# EAGLE design nav6 (EAGLE 6.4)

## Sheet 1 of 2
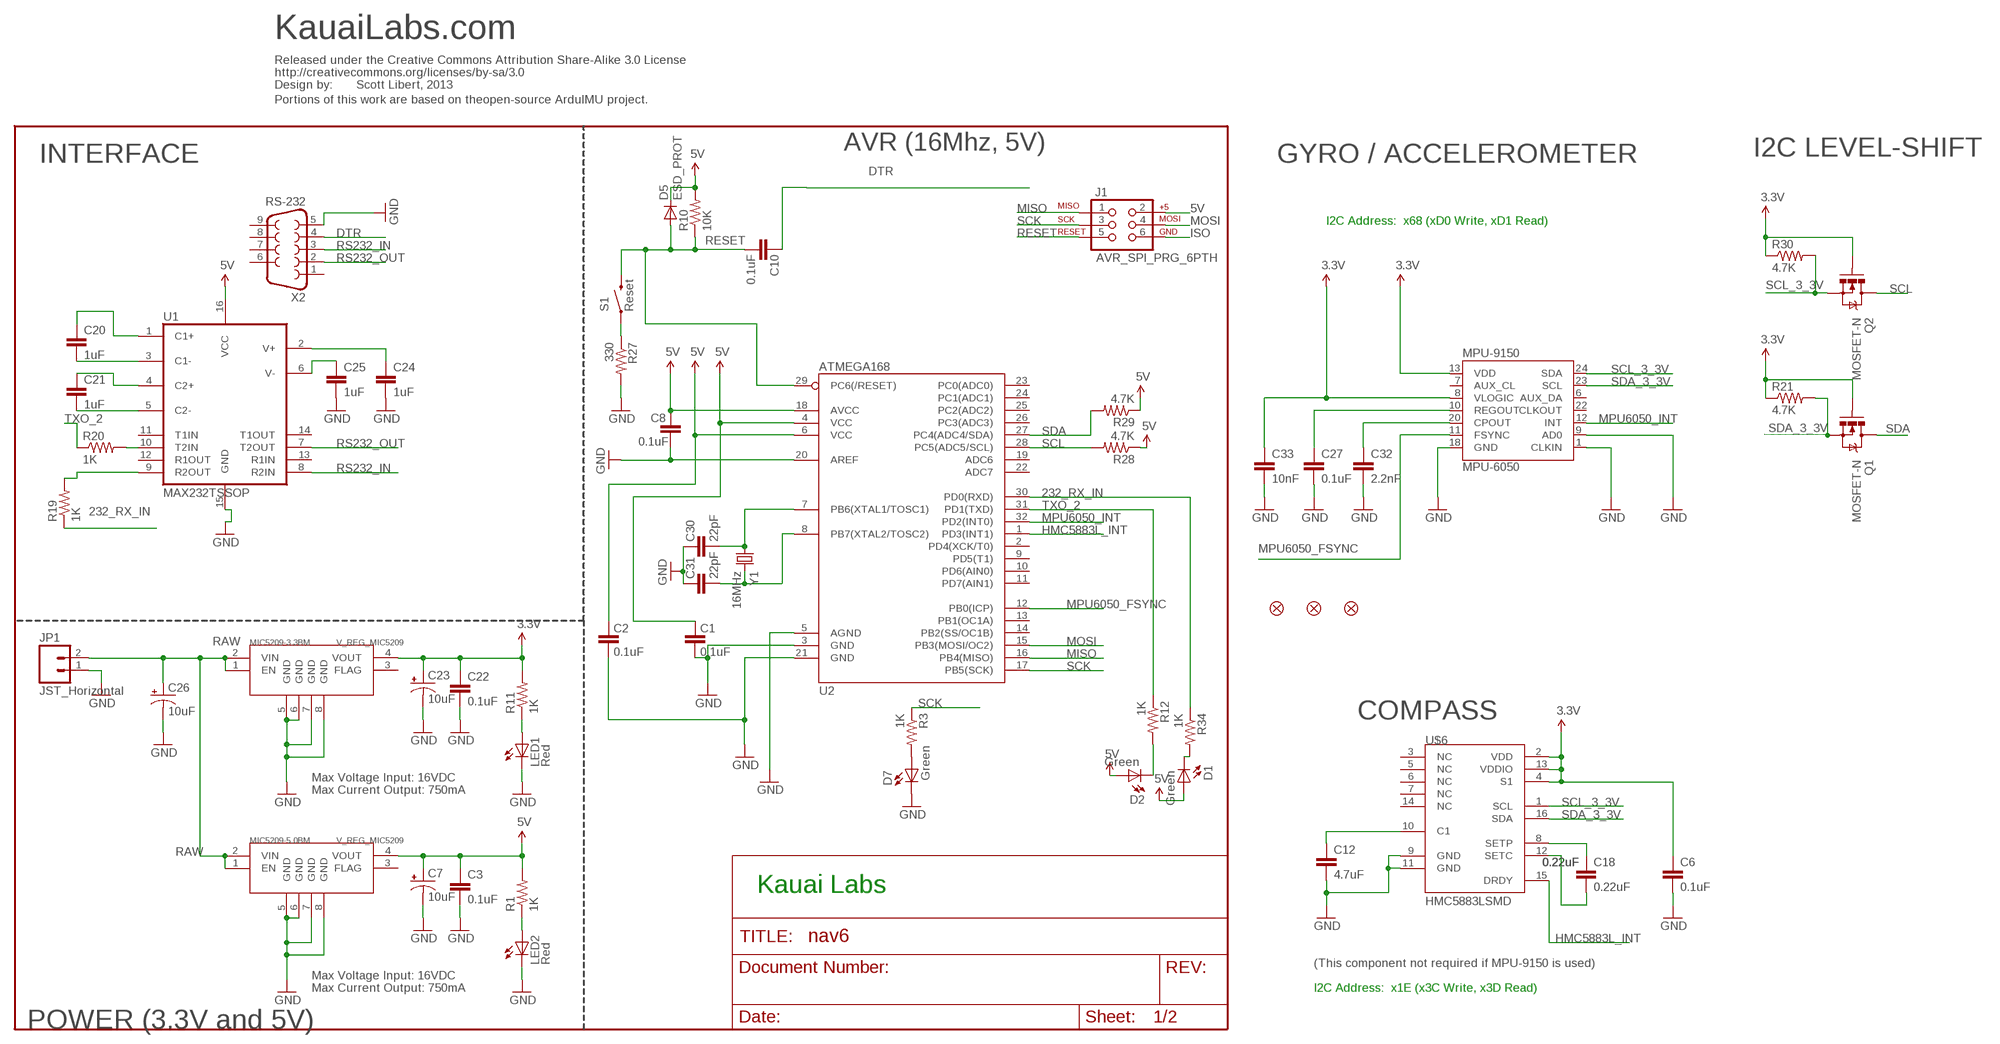
[diagram p0: schematic, sheet 1]

### Parts
C1  0.1uF  CAP0805  [0805]
C2  0.1uF  CAP0805  [0805]
C3  0.1uF  CAP0805  [0805]
C6  0.1uF  CAP0805  [0805]
C7  10uF  CAP_POL1206  [EIA3216]
C8  0.1uF  CAP0805  [0805]
C10  0.1uF  CAP0805  [0805]
C12  4.7uF  CAP0805  [0805]
C18  0.22uF  CAP0805  [0805]
C20  1uF  CAP0805  [0805]
C21  1uF  CAP0805  [0805]
C22  0.1uF  CAP0805  [0805]
C23  10uF  CAP_POL1206  [EIA3216]
C24  1uF  CAP0805  [0805]
C25  1uF  CAP0805  [0805]
C26  10uF  CAP_POL1206  [EIA3216]
C27  0.1uF  CAP0805  [0805]
C30  22pF  CAP0805  [0805]
C31  22pF  CAP0805  [0805]
C32  2.2nF  CAP0805  [0805]
C33  10nF  CAP0805  [0805]
D1  Green  LED1206  [LED-1206]
D2  Green  LED1206  [LED-1206]
D5  ESD_PROT  DIODESOD  [SOD-323]
D7  Green  LED1206  [LED-1206]
J1  AVR_SPI_PRG_6PTH  [2X3]
JP1  JST_Horizontal  M02-JST-2MM-SMT  [JST-2-SMD]
JP2  FIDUCIAL1.5X3  [FIDUCIAL-1.5X3]
JP3  FIDUCIAL1.5X3  [FIDUCIAL-1.5X3]
JP4  FIDUCIAL1.5X3  [FIDUCIAL-1.5X3]
LED1  Red  LED1206  [LED-1206]
LED2  Red  LED1206  [LED-1206]
MIC5209-3.3BM  V_REG_MIC5209  V_REG_MIC3975  [MSOP8]
MIC5209-5.0BM  V_REG_MIC5209  V_REG_MIC3975  [MSOP8]
MPU-9150  MPU-6050  [QFN24_INVENSENSE]
Q1  MOSFET-N  MOSFET-NCHANNELSOT323  [SOT323]
Q2  MOSFET-N  MOSFET-NCHANNELSOT323  [SOT323]
R1  1K  RESISTOR0805-RES  [0805]
R3  1K  RESISTOR0805-RES  [0805]
R10  10K  RESISTOR0805-RES  [0805]
R11  1K  RESISTOR0805-RES  [0805]
R12  1K  RESISTOR0805-RES  [0805]
R19  1K  RESISTOR0805-RES  [0805]
R20  1K  RESISTOR0805-RES  [0805]
R21  4.7K  RESISTOR0805-RES  [0805]
R27  330  RESISTOR0805-RES  [0805]
R28  4.7K  RESISTOR0805-RES  [0805]
R29  4.7K  RESISTOR0805-RES  [0805]
R30  4.7K  RESISTOR0805-RES  [0805]
R34  1K  RESISTOR0805-RES  [0805]
S1  Reset  SWITCH-MOMENTARY-2SMD  [TACTILE_SWITCH_SMD]
U1  MAX232TSSOP  [TSSOP16]
U2  ATMEGA168  [TQFP32-08]
U$1  CREATIVE_COMMONS  [CREATIVE_COMMONS]
U$6  HMC5883LSMD  [16LPCC]
X2  RS-232  DB9FEMALE  [DB9]
Y1  16MHz  CRYSTALTXC-7A  [CRYSTAL-TXC-7A]

### Nets
3.3V [vcc]: C6.1 C22.1 C23.A(+) C33.1 MIC5209-3.3BM.4(VOUT) MPU-9150.8(VLOGIC) MPU-9150.13(VDD) Q1.1(G) Q2.1(G) R11.2 R21.1 R30.1 U$6.2(VDD) U$6.4(S1) U$6.13(VDDIO)
5V [vcc]: C1.2 C2.2 C3.1 C7.A(+) C8.2 D1.A D2.A D5.1(C) J1.2 MIC5209-5.0BM.4(VOUT) R1.2 R10.2 R28.1 R29.1 U1.16(VCC) U2.4(VCC) U2.6(VCC) U2.18(AVCC)
232_RX_IN: R19.1 R34.1 U2.30(PD0(RXD))
DTR: C10.2 X2.4
HMC5883L_INT: U2.1(PD3(INT1)) U$6.15(DRDY)
ISO: C1.1 C2.1 C3.2 C6.2 C7.C(-) C8.1 C12.2 C22.2 C23.C(-) C24.2 C25.2 C26.C(-) C27.2 C30.2 C31.2 C32.2 C33.2 D7.C J1.6 JP1.1 LED1.C LED2.C MIC5209-3.3BM.5(GND) MIC5209-3.3BM.6(GND) MIC5209-3.3BM.7(GND) MIC5209-3.3BM.8(GND) MIC5209-5.0BM.5(GND) MIC5209-5.0BM.6(GND) MIC5209-5.0BM.7(GND) MIC5209-5.0BM.8(GND) MPU-9150.1(CLKIN) MPU-9150.9(AD0) MPU-9150.18(GND) R27.2 U1.15(GND) U2.3(GND) U2.5(AGND) U2.20(AREF) U2.21(GND) U$6.9(GND) U$6.11(GND) X2.5 ; supply symbol labelled GND
MISO: J1.1 U2.16(PB4(MISO))
MOSI: J1.4 U2.15(PB3(MOSI/OC2))
MPU6050_FSYNC: MPU-9150.11(FSYNC) U2.12(PB0(ICP))
MPU6050_INT: MPU-9150.12(INT) U2.32(PD2(INT0))
N$1: C30.1 U2.7(PB6(XTAL1/TOSC1)) Y1.P$1
N$2: C32.1 MPU-9150.20(CPOUT)
N$6: LED2.A R1.1
N$11: C18.2 U$6.8(SETP)
N$13: C18.1 U$6.12(SETC)
N$14: C12.1 U$6.10(C1)
N$15: D1.C R34.2
N$19: D7.A R3.2
N$20: D2.C R12.2
N$36: C24.1 U1.2(V+)
N$37: C25.1 U1.6(V-)
N$38: LED1.A R11.1
N$39: C20.1 U1.1(C1+)
N$40: C20.2 U1.3(C1-)
N$41: C21.1 U1.4(C2+)
N$42: C21.2 U1.5(C2-)
N$43: C27.1 MPU-9150.10(REGOUT)
N$44: R19.2 U1.9(R2OUT)
N$45: R20.2 U1.10(T2IN)
N$52: R27.1 S1.1
N$55: C31.1 U2.8(PB7(XTAL2/TOSC2)) Y1.P$2
RAW [vcc]: C26.A(+) JP1.2 MIC5209-3.3BM.1(EN) MIC5209-3.3BM.2(VIN) MIC5209-5.0BM.1(EN) MIC5209-5.0BM.2(VIN)
RESET: C10.1 D5.2(A) J1.5 R10.1 S1.3 U2.29(PC6(/RESET))
RS232_IN: U1.8(R2IN) X2.3
RS232_OUT: U1.7(T2OUT) X2.2
SCK: J1.3 R3.1 U2.17(PB5(SCK))
SCL: Q2.3(D) R28.2 U2.28(PC5(ADC5/SCL))
SCL_3_3V: MPU-9150.23(SCL) Q2.2(S) R30.2 U$6.1(SCL)
SDA: Q1.3(D) R29.2 U2.27(PC4(ADC4/SDA))
SDA_3_3V: MPU-9150.24(SDA) Q1.2(S) R21.2 U$6.16(SDA)
TXO_2: R12.1 R20.1 U2.31(PD1(TXD))
Unconnected: MIC5209-3.3BM.3(FLAG) MIC5209-5.0BM.3(FLAG) MPU-9150.6(AUX_DA) MPU-9150.7(AUX_CL) MPU-9150.22(CLKOUT) U1.11(T1IN) U1.12(R1OUT) U1.13(R1IN) U1.14(T1OUT) U2.2(PD4(XCK/T0)) U2.9(PD5(T1)) U2.10(PD6(AIN0)) U2.11(PD7(AIN1)) U2.13(PB1(OC1A)) U2.14(PB2(SS/OC1B)) U2.19(ADC6) U2.22(ADC7) U2.23(PC0(ADC0)) U2.24(PC1(ADC1)) U2.25(PC2(ADC2)) U2.26(PC3(ADC3)) U$6.3(NC) U$6.5(NC) U$6.6(NC) U$6.7(NC) U$6.14(NC) X2.1 X2.6 X2.7 X2.8 X2.9

### Notes on the sheet
- KauaiLabs.com
- Scott Libert, 2013
- Portions of this work are based on theopen-source ArduIMU project.
- AVR (16Mhz, 5V) | I2C LEVEL-SHIFT
- INTERFACE | GYRO / ACCELEROMETER
- I2C Address:  x68 (xD0 Write, xD1 Read)
- COMPASS
- Max Voltage Input: 16VDC
- Max Current Output: 750mA
- Kauai Labs
- (This component not required if MPU-9150 is used)
- Max Voltage Input: 16VDC
- Max Current Output: 750mA | I2C Address:  x1E (x3C Write, x3D Read)
- POWER (3.3V and 5V)

## Sheet 2 of 2
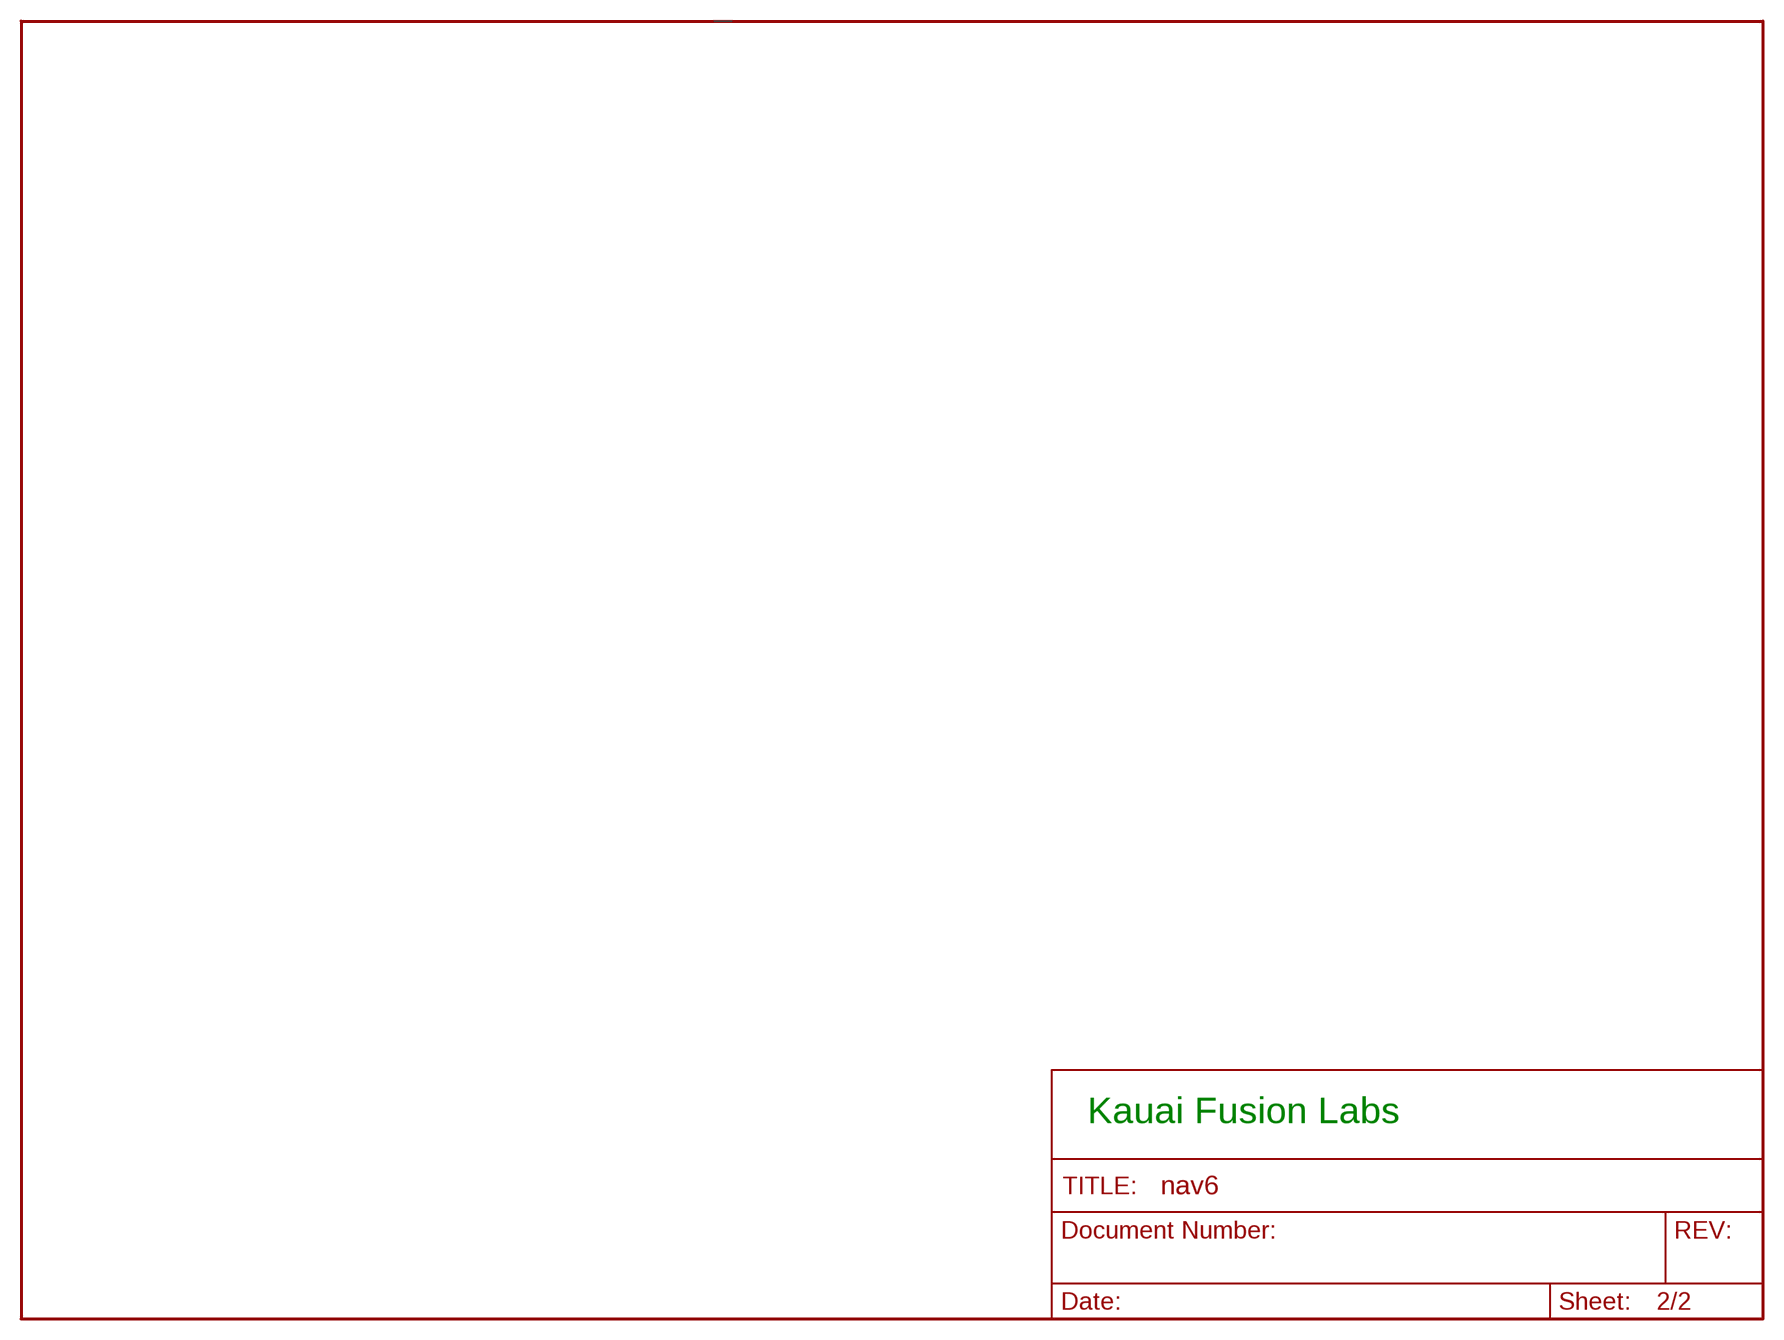
[diagram p1: schematic, sheet 2]

### Notes on the sheet
- Kauai Fusion Labs

## Library data of the parts
C1-C3 C8 C10 C20-C22 C24 C25 C27 C30-C33 = SparkFun:CAP: Capacitor Standard 0603 ceramic capacitor, and 0.1" leaded capacitor.
C6 = SparkFun:CAP: Capacitor Standard 0603 ceramic capacitor, and 0.1" leaded capacitor.; DIGIKEY#: 445-3462-1-ND
C7 C23 C26 = SparkFun:CAP_POL: Capacitor Polarized These are standard SMD and PTH capacitors. Normally 10uF, 47uF, and 100uF in electrolytic and tantalum varieties. Always verify the external diameter of the through hole cap, it varies with capacity, voltage, and manufacturer. The EIA devices should be standard.
C12 = SparkFun:CAP: Capacitor Standard 0603 ceramic capacitor, and 0.1" leaded capacitor.; DIGIKEY#: 445-3457-1-ND
C18 = SparkFun:CAP: Capacitor Standard 0603 ceramic capacitor, and 0.1" leaded capacitor.; DIGIKEY#: 445-1350-1-ND
D1 D2 D7 LED1 LED2 = SparkFun:LED: LEDs Standard schematic elements and footprints for 5mm, 3mm, 1206, and 0603 sized LEDs. 5mm - Spark Fun Electronics SKU : COM-00529 (and others)
D5 = SparkFun-DiscreteSemi:DIODE: Diode These are standard reverse protection diodes and small signal diodes. SMA package can handle up to about 1A. SOD-323 can handle about 200mA. What the SOD-323 package when ordering, there are some mfgs out there that are 5-pin packages.
J1 = SparkFun:AVR_SPI_PRG_6: AVR ISP 6 Pin This is the reduced ISP connector for AVR programming. Common on Arduino. This footprint will take up less PCB space and can be used with a 10-pin to 6-pin adapter such as SKU: BOB-08508
JP1 = SparkFun:M02: Header 2 Standard 2-pin 0.1" header. Use with straight break away headers (SKU : PRT-00116), right angle break away headers (PRT-00553), swiss pins (PRT-00743), machine pins (PRT-00117), and female headers (PRT-00115). Molex polarized connector foot print use with SKU : PRT-08233 with associated crimp pins and housings.
JP2-JP4 = SparkFun:FIDUCIAL: Fiducial Alignment Points Various fiducial points for machine vision alignment.
MIC5209-3.3BM MIC5209-5.0BM = SparkFun-PowerIC:V_REG_MIC3975
MPU-9150 = KauaiFusionLabs:MPU-6050
Q1 Q2 = SparkFun-DiscreteSemi:MOSFET-NCHANNEL: Generic NMOS footprint
R1 R3 R10-R12 R19-R21 R27-R30 R34 = SparkFun:RESISTOR: Resistor Basic schematic elements and footprints for 0603, 1206, and PTH resistors.
S1 = SparkFun:SWITCH-MOMENTARY-2
U1 = SparkFun-DigitalIC:MAX232: RS232 Transceiver Very common IC. This is generically called 'MAX232', but works with the 3V equivalent MAX3232 generic ICs. Field tested and mother approved. Spark Fun Electronics SKU : COM-00316 (DIP) and COM-00589 (SMD)
U2 = SparkFun:ATMEGA168
U$1 = SparkFun:CREATIVE_COMMONS
U$6 = SparkFun:HMC5883L: 3 Axis Digital Compass IC; DIGIKEY#: 342-1082-1-ND
X2 = SparkFun-Connectors:DB9: DB9 Connector Standard DB9 (D-Sub 9) serial connector. Can be used for CAN bus as well as RS485 and RS232. Footprint production proven. Spark Fun Electronics SKU : PRT-00429
Y1 = SparkFun-FreqCtrl:CRYSTAL: Various standard crystals. Proven footprints. Spark Fun Electronics SKU : COM-00534

## Net classes
1 vcc: width 0.254 mm

## Board
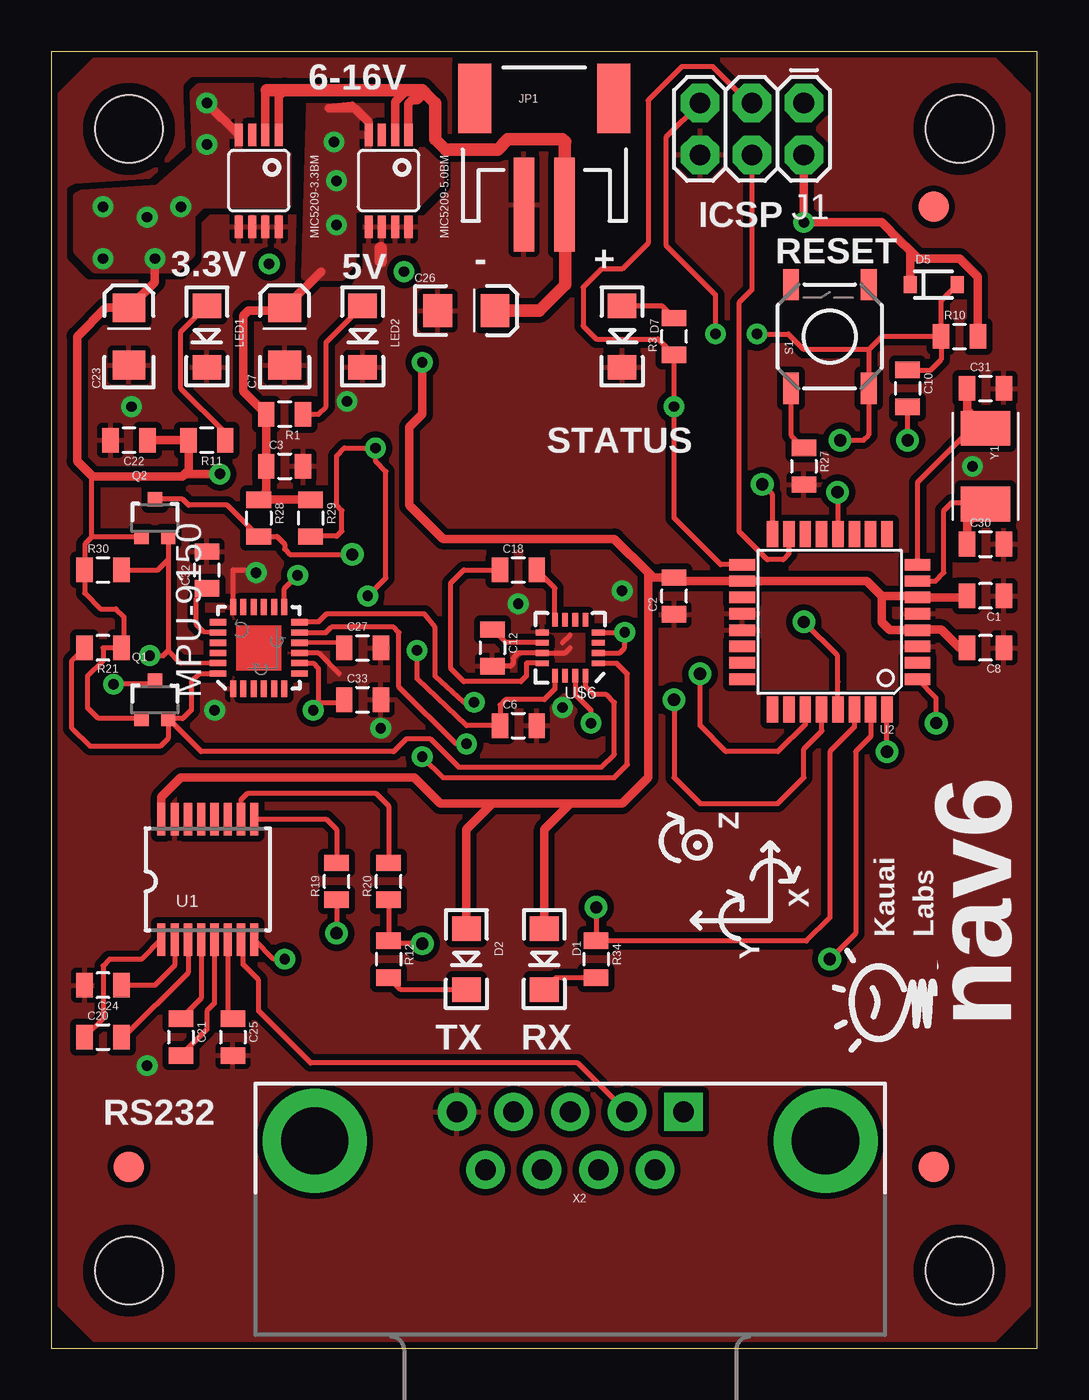
[diagram p2: board, top side]
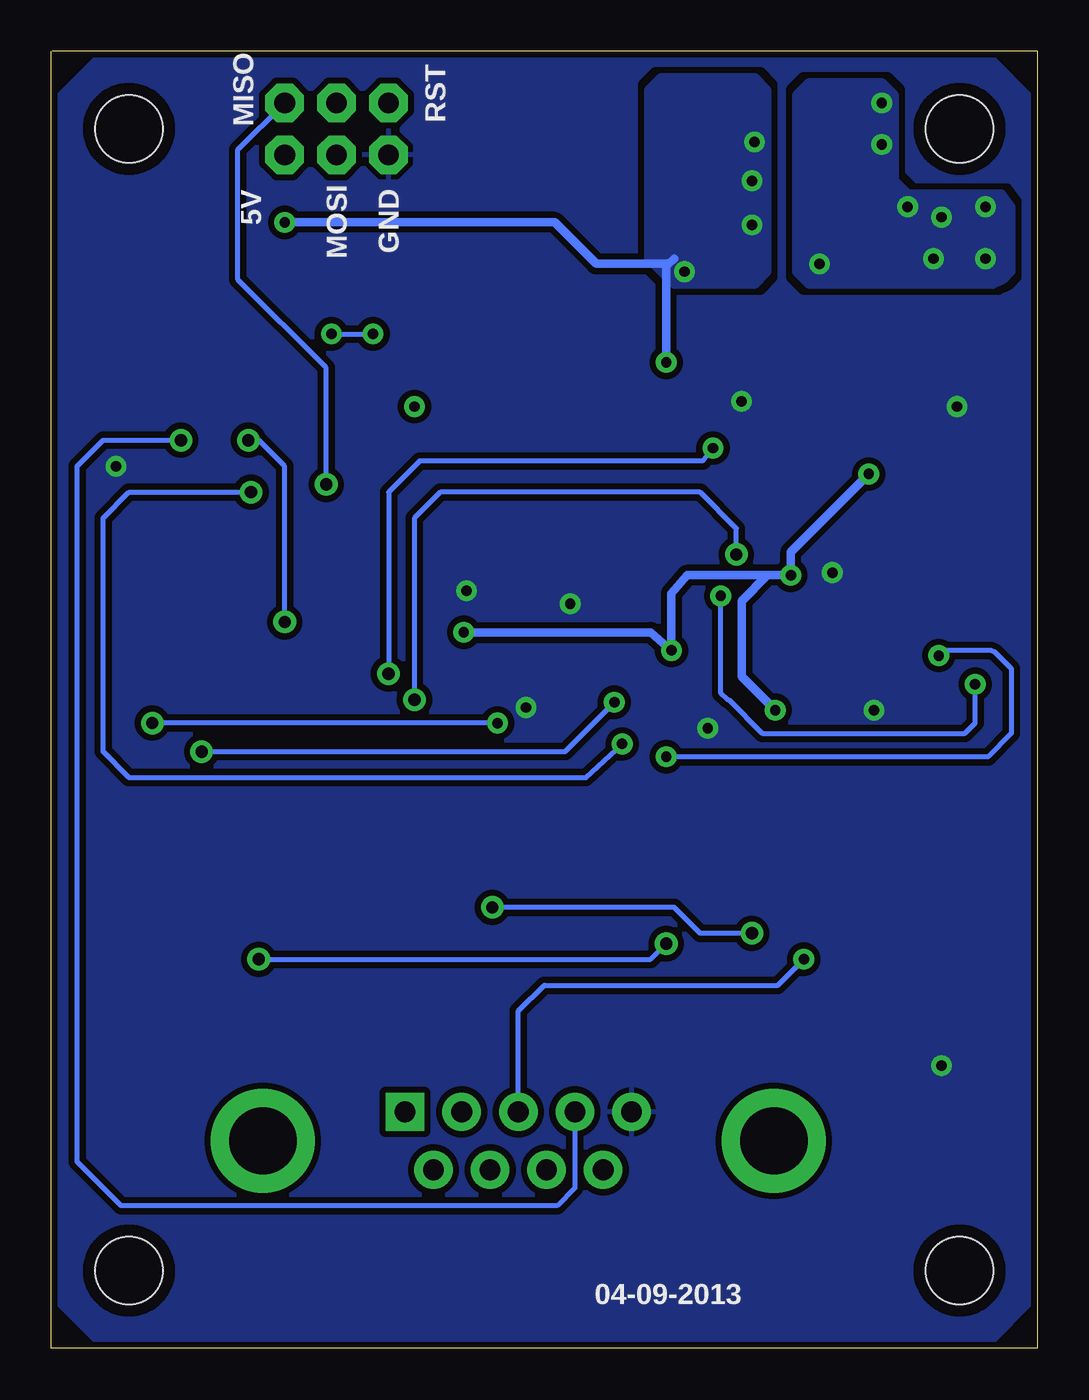
[diagram p3: board, bottom side, seen from below]

Size 48.26 x 63.5 mm. Coordinates in mm from the lower left corner, seen from the top.
Outline: 48.26,63.5 48.26,0 0,0 0,63.49
Outline: 0,63.5 48.2,63.5
Copper layers (1*16): Top 0.035mm / dielectric 1.5mm / Bottom 0.035mm
Design rules "default": minimum track width 8mil, minimum drill 20mil, track to track 8mil, track to pad 8mil, pad to pad 8mil, via to via 8mil, smd to smd 8mil, copper to edge 10mil, drill to drill 8mil, minimum pad ring 12mil, minimum via ring 10mil, stop-mask expansion 4mil, vias tented up to drill 25mil, thermal gap 10mil

### Footprints (pad centres in the part's own frame; a part is rotated, then mirrored left to right if it is on the bottom)
0805 = smd 0.8 x 1.2: 1 -0.9,0; 2 0.9,0
EIA3216 = smd 1.4 x 1.6: A 1.4,0; C -1.4,0
LED-1206 = smd 1.2 x 1.4: A -1.5,0; C 1.5,0
SOD-323 = smd 0.63 x 0.83: 1 -1.15,0; 2 1.15,0
2X3 = drill 1.016 pad 1.88 octagon: 1 0,0; 2 0,2.54; 3 2.54,0; 4 2.54,2.54; 5 5.08,0; 6 5.08,2.54
JST-2-SMD = smd 1 x 4.6: 1 -1,-3.7; 2 1,-3.7 | smd 1.6 x 3.4: NC1 -3.4,1.5; NC2 3.4,1.5
FIDUCIAL-1.5X3 = smd 1.5 x 1.5: 1 0,0
MSOP8 = smd 0.4 x 1.1: 1 -0.975,-2.25; 2 -0.325,-2.25; 3 0.325,-2.25; 4 0.975,-2.25; 5 0.975,2.25; 6 0.325,2.25; 7 -0.325,2.25; 8 -0.975,2.25
QFN24_INVENSENSE = smd 0.8 x 0.3: 1 -2,1.25; 2 -2,0.75; 3 -2,0.25; 4 -2,-0.25; 5 -2,-0.75; 6 -2,-1.25; 13 2,-1.25; 14 2,-0.75; 15 2,-0.25; 16 2,0.25; 17 2,0.75; 18 2,1.25 | smd 0.3 x 0.8: 7 -1.25,-2; 8 -0.75,-2; 9 -0.25,-2; 10 0.25,-2; 11 0.75,-2; 12 1.25,-2; 19 1.25,2; 20 0.75,2; 21 0.25,2; 22 -0.25,2; 23 -0.75,2; 24 -1.25,2
SOT323 = smd 0.7 x 0.7: 1 -0.65,-0.925; 2 0.65,-0.925; 3 0,0.925
TACTILE_SWITCH_SMD = smd 1.524 x 0.762: 1 -2.54,1.905; 2 2.54,1.905; 3 -2.54,-1.905; 4 2.54,-1.905
TSSOP16 = smd 0.4 x 1.6: 1 -2.225,-2.85; 2 -1.575,-2.85; 3 -0.925,-2.85; 4 -0.275,-2.85; 5 0.375,-2.85; 6 1.025,-2.85; 7 1.675,-2.85; 8 2.325,-2.85; 9 2.325,3.05; 10 1.675,3.05; 11 1.025,3.05; 12 0.375,3.05; 13 -0.275,3.05; 14 -0.925,3.05; 15 -1.575,3.05; 16 -2.225,3.05
TQFP32-08 = smd 1.27 x 0.559: 1 -4.293,2.8; 2 -4.293,2; 3 -4.293,1.2; 4 -4.293,0.4; 5 -4.293,-0.4; 6 -4.293,-1.2; 7 -4.293,-2; 8 -4.293,-2.8; 17 4.293,-2.8; 18 4.293,-2; 19 4.293,-1.2; 20 4.293,-0.4; 21 4.293,0.4; 22 4.293,1.2; 23 4.293,2; 24 4.293,2.8 | smd 0.559 x 1.27: 9 -2.8,-4.293; 10 -2,-4.293; 11 -1.2,-4.293; 12 -0.4,-4.293; 13 0.4,-4.293; 14 1.2,-4.293; 15 2,-4.293; 16 2.8,-4.293; 25 2.8,4.293; 26 2,4.293; 27 1.2,4.293; 28 0.4,4.293; 29 -0.4,4.293; 30 -1.2,4.293; 31 -2,4.293; 32 -2.8,4.293
STAND-OFF = hole 3.302: 0,0
16LPCC = smd 0.65 x 0.28: 1 -1.37,0.75; 2 -1.37,0.25; 3 -1.37,-0.25; 4 -1.37,-0.75; 9 1.37,-0.75; 10 1.37,-0.25; 11 1.37,0.25; 12 1.37,0.75 | smd 0.28 x 0.65: 5 -0.75,-1.37; 6 -0.25,-1.37; 7 0.25,-1.37; 8 0.75,-1.37; 13 0.75,1.37; 14 0.25,1.37; 15 -0.25,1.37; 16 -0.75,1.37
DB9 = drill 1.016 pad 1.88 square: 1 -5.54,-1.42 | drill 1.016 pad 1.88: 2 -2.77,-1.42; 3 0,-1.42; 4 2.77,-1.42; 5 5.54,-1.42; 6 -4.15,1.42; 7 -1.38,1.42; 8 1.38,1.42; 9 4.15,1.42 | drill 3.302 pad 5.08: G1 -12.5,0; G2 12.5,0
CRYSTAL-TXC-7A = smd 1.7 x 2.4: P$1 1.85,0; P$2 -1.85,0

### Placement (x,y rotation side)
C1  45.72,36.83 180 top
C2  30.48,36.83 90 top
C3  11.43,43.18 0 top
C6  22.86,30.48 0 top
C7  11.43,49.53 90 top
C8  45.72,34.29 180 top
C10  41.91,46.99 270 top
C12  21.59,34.29 270 top
C18  22.86,38.1 0 top
C20  2.54,15.24 0 top
C21  6.35,15.24 270 top
C22  3.81,44.45 180 top
C23  3.81,49.53 90 top
C24  2.54,17.78 180 top
C25  8.89,15.24 270 top
C26  20.32,50.8 0 top
C27  15.24,34.29 0 top
C30  45.72,39.37 0 top
C31  45.72,46.99 0 top
C32  7.62,38.1 90 top
C33  15.24,31.75 0 top
D1  24.13,19.05 270 top
D2  20.32,19.05 270 top
D5  43.18,52.07 0 top
D7  27.94,49.53 270 top
J1  36.83,60.96 180 top
JP1  24.13,59.69 0 top
JP2  3.81,8.89 0 top
JP3  43.18,8.89 0 top
JP4  43.18,55.88 0 top
LED1  7.62,49.53 270 top
LED2  15.24,49.53 270 top
MIC5209-3.3BM  10.16,57.15 180 top
MIC5209-5.0BM  16.51,57.15 180 top
MPU-9150  10.16,34.29 90 top
Q1  5.08,31.75 0 top
Q2  5.08,40.64 0 top
R1  11.43,45.72 180 top
R3  30.48,49.53 90 top
R10  44.45,49.53 0 top
R11  7.62,44.45 180 top
R12  16.51,19.05 270 top
R19  13.97,22.86 90 top
R20  16.51,22.86 90 top
R21  2.54,34.29 180 top
R27  36.83,43.18 270 top
R28  10.16,40.64 270 top
R29  12.7,40.64 270 top
R30  2.54,38.1 0 top
R34  26.67,19.05 270 top
S1  38.1,49.53 90 top
U1  7.62,22.86 0 top
U2  38.1,35.56 180 top
U$2  STAND-OFF  [STAND-OFF]  3.81,3.81 0 top
U$3  STAND-OFF  [STAND-OFF]  44.45,59.69 0 top
U$4  STAND-OFF  [STAND-OFF]  3.81,59.69 0 top
U$6  25.4,34.29 180 top
U$8  STAND-OFF  [STAND-OFF]  44.45,3.81 0 top
X2  25.4,10.16 180 top
Y1  45.72,43.18 270 top

### Tracks (layer width: path | path; a pad name or v marks a point on that pad's centre or on a via)
3.3V  (via drill 0.51)
  Top 0.254: Q2.1 2,39.71 | 2,39.71 1.65,39.37 1.65,38.11 R30.1 1.64,36.97 2.41,36.2 3.17,36.2 3.56,35.81 3.56,34.41 R21.1 2.54,34.29 2.54,33.66 1.78,32.89 1.78,31.37 2.29,30.86 4.39,30.86 Q1.1 | 2,39.71 2,42.71 1.4,43.31 | U$6.13 24.65,32.27 24.13,31.75 22.23,31.75 21.97,31.5 21.97,30.49 C6.1 20.32,30.48 17.91,32.77 v17.91,34.16 | U$6.4 28.05,35.04 v28.07,35.05 28.07,34.29 27.82,34.04 U$6.2 | MPU-9150.13 11.41,37.19 v12.06,37.85 | 13.08,31.62 13.08,33.27 12.81,33.54 MPU-9150.8 | 13.08,31.62 v12.83,31.24 | 13.08,31.62 14.21,31.62 C33.1
  Top 0.406: 6.54,42.8 6.41,42.67 2.03,42.67 1.4,43.31 1.27,43.43 1.27,49.53 2.67,50.93 C23.A 5.08,52.2 v5.08,53.34 | 6.54,42.8 6.73,42.99 R11.2 C22.1 | 6.54,42.8 v8.25,42.8 | 7.91,60.66 v7.62,60.96 MIC5209-3.3BM.4
  Bottom 0.406: v12.06,37.85 12.06,38.99 v8.25,42.8 | v12.06,37.85 17.14,37.85 17.91,36.96 v17.91,34.16 18.92,35.05 v28.07,35.05 | v12.06,37.85 13.21,37.85 14.48,36.58 14.48,32.89 v12.83,31.24
  other vias: 2.54,55.88 2.54,53.34 4.7,55.37 6.35,55.88 7.62,58.93 10.67,53.09
  pour Top (isolate 0.305): 11.56,56.01 11.56,60.83 10.67,61.72 7.24,61.72 6.98,61.47 7.11,58.42 5.21,56.77 1.52,56.52 1.27,56.39 1.27,53.72 2.16,52.83 6.1,52.83 6.86,53.59 6.86,55.5 7.37,56.01
  pour Bottom (isolate 0.305): 1.78,56.52 6.35,56.52 6.98,57.15 6.98,61.34 7.62,61.98 11.18,61.98 11.81,61.34 11.81,52.7 11.18,52.07 2.17,52.07 1.84,52.21 1.63,52.35 1.27,52.7 1.27,55.89 1.75,56.51
5V  (via drill 0.51)
  Top 0.254: 36.83,58.05 J1.2
  Top 0.406: J1.2 v36.83,55.12 40.64,55.12 41.53,54.23 42.03,53.73 | R10.2 45.34,49.54 45.34,52.45 44.45,53.34 42.42,53.34 42.03,53.73 | C7.A | R29.1 R28.1 10.53,41.91 C3.1 R1.2 9.4,46.85 9.4,50.55 9.65,50.8 11.3,50.8 C7.A | 13.21,52.71 C7.A | 14.73,60.83 13.59,60.71 14.86,60.71 15.53,60.03 MIC5209-5.0BM.4 | v18.16,48.26 18.16,45.72 17.53,45.09 17.53,41.27 19.18,39.62 27.56,39.62 29.21,37.97 | 29.21,37.97 29.45,37.73 C2.2 30.65,37.56 U2.18 39.91,37.56 40.64,36.83 | 40.64,36.83 42.32,36.83 U2.6 44.75,36.76 C1.2 | 40.64,36.83 40.64,35.56 41.04,35.16 U2.4 42.41,35.18 43.56,35.18 44.45,34.29 C8.2 | U1.16 5.39,26.98 6.35,27.94 17.78,27.94 19.05,26.67 21.59,26.67 | 21.59,26.67 25.4,26.67 | 25.4,26.67 27.94,26.67 29.21,27.94 29.21,37.97 | D2.A 20.32,25.4 21.59,26.67 | D1.A 24.13,25.4 25.4,26.67 | D5.1 42.03,53.73
  Bottom 0.406: 18.03,53.09 21.59,53.09 23.62,55.12 v36.83,55.12 | 18.03,53.09 17.78,53.34 | v18.16,48.26 18.16,52.96 18.03,53.09
  other vias: 13.97,57.15 13.97,54.99 17.27,52.7 13.84,59.05
  pour Top (isolate 0.305): 12.45,52.45 14.22,52.45 14.73,53.21 14.73,55.75 17.78,55.88 19.05,57.15 19.05,62.48 13.46,62.48 12.7,61.72
  pour Bottom (isolate 0.305): 19.05,53.34 19.05,61.59 18.41,62.23 13.84,62.23 13.21,61.59 13.21,52.7 13.84,52.07 17.78,52.07
232_RX_IN  (via drill 0.6)
  Top 0.254: U2.30 39.3,30.41 38.1,29.21 38.1,21.08 36.96,19.94 R34.1 v26.67,21.59 | R19.1 v13.97,20.32
  Bottom 0.254: v13.97,20.32 16.51,20.32 17.78,21.59 v26.67,21.59
DTR  (via drill 0.6)
  Top 0.254: v41.91,44.45 C10.2
  Bottom 0.254: X2.4 22.63,7.85 23.49,6.99 44.83,6.99 46.99,9.14 46.99,43.18 45.72,44.45 v41.91,44.45
HMC5883L_INT  (via drill 0.51, 0.6)
  Top 0.254: U$6.15 25.65,32.01 26.42,31.24 v26.42,30.61 | v43.31,30.61 43.31,31.85 U2.1
  Bottom 0.254: v26.42,30.61 v43.31,30.61
ISO  (via drill 0.51)
  Top 0.254: 25.02,34.54 25.4,34.92 | 25.4,34.29 25.15,34.04 U$6.11 22.86,34.04 22.61,33.78 22.61,33.53 22.48,33.4 21.6,33.4 C12.2 | MPU-9150.18 8.9,38.09 8.89,38.1 9.91,38.1 v10.03,37.97 | 14.1,33.02 13.08,34.03 MPU-9150.9
  Top 0.61: 16.13,53.21 16.13,53.85
  other vias: 3.94,46.1 14.48,46.35 8,31.24 27.94,37.08 16.13,30.35 25.02,31.37 4.7,13.84 22.86,36.45 45.09,43.18
  pour Bottom (isolate 0.305, rank 2): 0,60.96 0,2.54 2.54,0 45.72,0 48.26,2.54 48.26,60.96 45.72,63.5 2.54,63.5
  pour Top (isolate 0.305, rank 2): 0,60.96 0,2.54 2.54,0 45.72,0 48.26,2.54 48.26,60.96 45.72,63.5 2.54,63.5
  pour Top (isolate 0.305): 43.18,46.99 44.45,48.26 47.62,48.26 47.62,38.48 47.24,38.1 44.32,38.1 43.05,39.37 43.05,46.86
MISO  (via drill 0.6)
  Top 0.254: U2.16 35.3,41.79 v34.8,42.29
  Bottom 0.254: v34.8,42.29 34.8,48.01 39.12,52.32 39.12,58.67 J1.1
MOSI
  Top 0.254: U2.15 36.1,38.89 35.81,38.61 35.05,38.61 33.66,40 33.66,51.18 34.29,51.82 J1.4
MPU6050_FSYNC  (via drill 0.51, 0.6)
  Top 0.254: MPU-9150.11 13.45,35.04 13.72,35.31 16.76,35.31 17.02,35.05 17.02,32.38 19.81,29.59 v20.32,29.59 | v38.48,41.91 38.48,39.87 U2.12
  Bottom 0.254: v20.32,29.59 22.1,27.94 44.45,27.94 45.72,29.21 45.72,40.64 44.45,41.91 v38.48,41.91
MPU6050_INT  (via drill 0.51, 0.6)
  Top 0.254: MPU-9150.12 12.27,35.56 13.08,35.56 13.46,35.94 18.29,35.94 18.8,35.31 18.8,32.89 20.19,31.62 v20.7,31.62 | v40.89,29.21 U2.32
  Bottom 0.254: v40.89,29.21 23.11,29.21 v20.7,31.62
N$1
  Top 0.254: U2.7 43.27,37.56 43.69,37.97 43.69,41.02 44.07,41.4 45.65,41.4
  Top 0.406: 45.65,41.4 Y1.P$1 44.82,40.43 C30.1
N$2
  Top 0.254: 8.06,35.05 MPU-9150.20 7.47,35.07 7.11,35.43 7.11,36.69 C32.1
N$6
  Top 0.254: R1.1 13.08,45.72 13.46,46.1 13.46,49.25 LED2.A
N$11
  Top 0.254: U$6.8 24.65,37.21 C18.2
N$13
  Top 0.254: C18.1 20.19,38.1 19.56,37.46 19.56,33.27 20.19,32.64 22.99,32.64 23.25,32.91 23.25,33.54 U$6.12
N$14
  Top 0.254: U$6.10 22.24,34.54 C12.1
N$15
  Top 0.254: D1.C 24.73,18.15 R34.2
N$19
  Top 0.254: 30.34,50.43 R3.2 29.88,51.03 D7.A
N$20
  Top 0.254: D2.C 17.11,17.55 R12.2
N$36
  Top 0.254: U1.2 6.04,18.74 5.08,17.78 C24.1
N$37
  Top 0.254: U1.6 8.64,16.38 C25.1
N$38
  Top 0.254: R11.1 8.52,44.82 6.35,46.99 6.35,49.76 LED1.A
N$39
  Top 0.254: 5.32,19.94 U1.1 4.43,19.05 2.86,19.05 2.54,18.73 2.54,16.14 C20.1
N$40
  Top 0.254: C20.2 3.56,15.24 6.73,18.41 6.73,19.97 U1.3
N$41
  Top 0.254: U1.4 7.34,17.13 C21.1
N$42
  Top 0.254: U1.5 7.99,16.88 7.62,16.51 7.62,15.61 C21.2
N$43
  Top 0.254: 12.3,34.54 MPU-9150.10 14.06,34.57 C27.1
N$44
  Top 0.254: 9.91,25.87 U1.9 13.46,25.91 13.97,25.4 R19.2
N$45
  Top 0.254: U1.10 9.29,26.86 9.63,27.18 9.65,27.18 15.88,27.18 16.51,26.54 R20.2
N$52
  Top 0.254: S1.1 36.2,44.71 R27.1
N$55
  Top 0.254: 42.39,38.46 42.39,42.39 45.38,45.38
  Top 0.406: U2.8 42.39,38.46 | C31.1 44.82,45.93 45.38,45.38 Y1.P$2
RAW
  Top 0.406: MIC5209-5.0BM.2 16.84,61.03 17.4,61.59 | MIC5209-3.3BM.2 10.48,61.54 10.54,61.59 | MIC5209-3.3BM.1 11.13,61.3 11.43,61.59 | MIC5209-5.0BM.1 17.48,60.92 17.65,61.09 17.91,61.09 18.29,61.47
  Top 0.61: C26.A 23.88,50.8 25.15,52.07 25.15,55.97 JP1.2 25.13,59.04 25.15,59.05 25.02,59.18 22.35,59.18 21.84,58.67 19.3,58.67 18.8,59.18 18.8,60.96 18.29,61.47 18.16,61.59 17.4,61.59 11.43,61.59 10.54,61.59
RESET  (via drill 0.51, 0.6)
  Top 0.254: v32.51,49.66 32.51,51.56 30.1,53.98 30.1,59.31 J1.5 | R10.1 43.55,48.4 43.04,47.89 C10.1 | v34.54,49.66 36.07,49.66 36.83,48.89 40,48.89 | 40,48.89 S1.3 40,44.71 39.74,44.45 v38.61,44.45 | R10.1 40.64,49.53 40,48.89 | U2.29 38.5,32.62 38.48,33.91 v36.83,35.56 | R10.1 43.55,51.29 D5.2
  Bottom 0.254: v34.54,49.66 v32.51,49.66 | v36.83,35.56 36.83,43.18 38.1,44.45 v38.61,44.45
RS232_IN  (via drill 0.51)
  Top 0.254: v11.43,19.05 10.9,19.05 U1.8
  Bottom 0.254: v11.43,19.05 12.7,17.78 24.13,17.78 25.4,16.51 X2.3
RS232_OUT
  Top 0.254: 9.27,19.99 U1.7 9.4,19.91 9.4,18.8 10.16,18.03 10.16,16.51 12.7,13.97 25.78,13.97 X2.2
SCK  (via drill 0.51)
  Top 0.254: U2.17 32.76,38.36 30.48,40.64 v30.48,46.1 R3.1 29.71,49.4 26.67,49.4 26.03,50.04 26.03,51.94 26.92,52.83 27.94,52.83 29.21,54.1 29.21,61.09 30.86,62.74 32.38,62.74 34.16,60.96 J1.3
SCL  (via drill 0.6)
  Top 0.254: Q2.3 6.44,41.56 6.73,41.27 8.62,41.27 R28.2 11.06,39.74 11.43,39.37 11.43,39.12 11.68,38.86 v14.73,38.86 | U2.28 37.72,31.25 37.72,30.23 36.83,29.34 36.83,27.94 35.56,26.67 31.75,26.67 30.48,27.94 v30.48,31.75
  Bottom 0.254: v14.73,38.86 14.73,40.13 16.51,41.91 29.21,41.91 30.48,40.64 v30.48,31.75
SCL_3_3V  (via drill 0.51)
  Top 0.254: Q2.2 5.73,38.61 | 5.73,38.61 5.73,34.15 | 8.08,33.53 MPU-9150.23 6.35,33.53 5.73,34.15 | R30.2 5.22,38.1 5.73,38.61 | v4.83,33.91 5.49,33.91 5.73,34.15 | v18.16,28.96 19.18,27.94 27.56,27.94 28.19,28.57 28.19,33.02 27.69,33.53 26.78,33.53 U$6.1
  Bottom 0.254: v4.83,33.91 4.57,34.16 2.29,34.16 2.07,34.07 1.27,33.27 1.27,30.1 2.41,28.96 v18.16,28.96
SDA  (via drill 0.51, 0.6)
  Top 0.254: Q1.3 4.92,32.51 v3.05,32.51 | v15.49,36.83 16.38,37.72 16.38,42.93 15.88,43.43 v15.88,44.07 14.35,44.07 13.97,43.69 13.97,41.27 14.22,41.02 14.22,40 13.97,39.75 R29.2 | U2.27 36.9,30.55 35.56,29.21 33.02,29.21 31.75,30.48 v31.75,33.02
  Bottom 0.254: v15.88,44.07 16.38,43.43 30.23,43.43 31.75,41.91 v31.75,33.02 | v15.49,36.83 15.49,32.07 15.18,31.75 15.11,31.75 13.46,30.1 3.56,30.1 3.05,30.61 v3.05,32.51
SDA_3_3V
  Top 0.254: MPU-9150.24 8.07,33.02 7.24,33.02 6.86,32.64 6.86,31.24 6.44,30.82 Q1.2 | Q1.2 5.73,29.86 5.33,29.46 1.9,29.46 1.02,30.35 1.02,33.67 R21.2 1.65,34.28 | U$6.16 26.16,32.91 26.16,32.38 26.54,32 27.18,32 27.56,31.62 27.56,29.08 26.92,28.45 19.94,28.45 18.54,29.84 17.4,29.84 16.76,29.21 7.34,29.21 Q1.2
TXO_2  (via drill 0.6)
  Top 0.254: 16.37,21.96 R20.1 R12.1 16.65,19.81 v18.16,19.81 | U2.31 40.1,29.94 39.37,29.21 39.37,20.32 v38.1,19.05
  Bottom 0.254: v38.1,19.05 18.92,19.05 v18.16,19.81

### Text on the board
tPlace: 6-16V | ICSP | 3.3V | 5V | - | + | RESET | STATUS | Z | X | Kauai | Labs | Y | nav6 | TX | RX | RS232
bPlace: RST | MISO | GND | 5V | MOSI | 04-09-2013